# Altium schematic sheet Sheet2.SchDoc
size A3
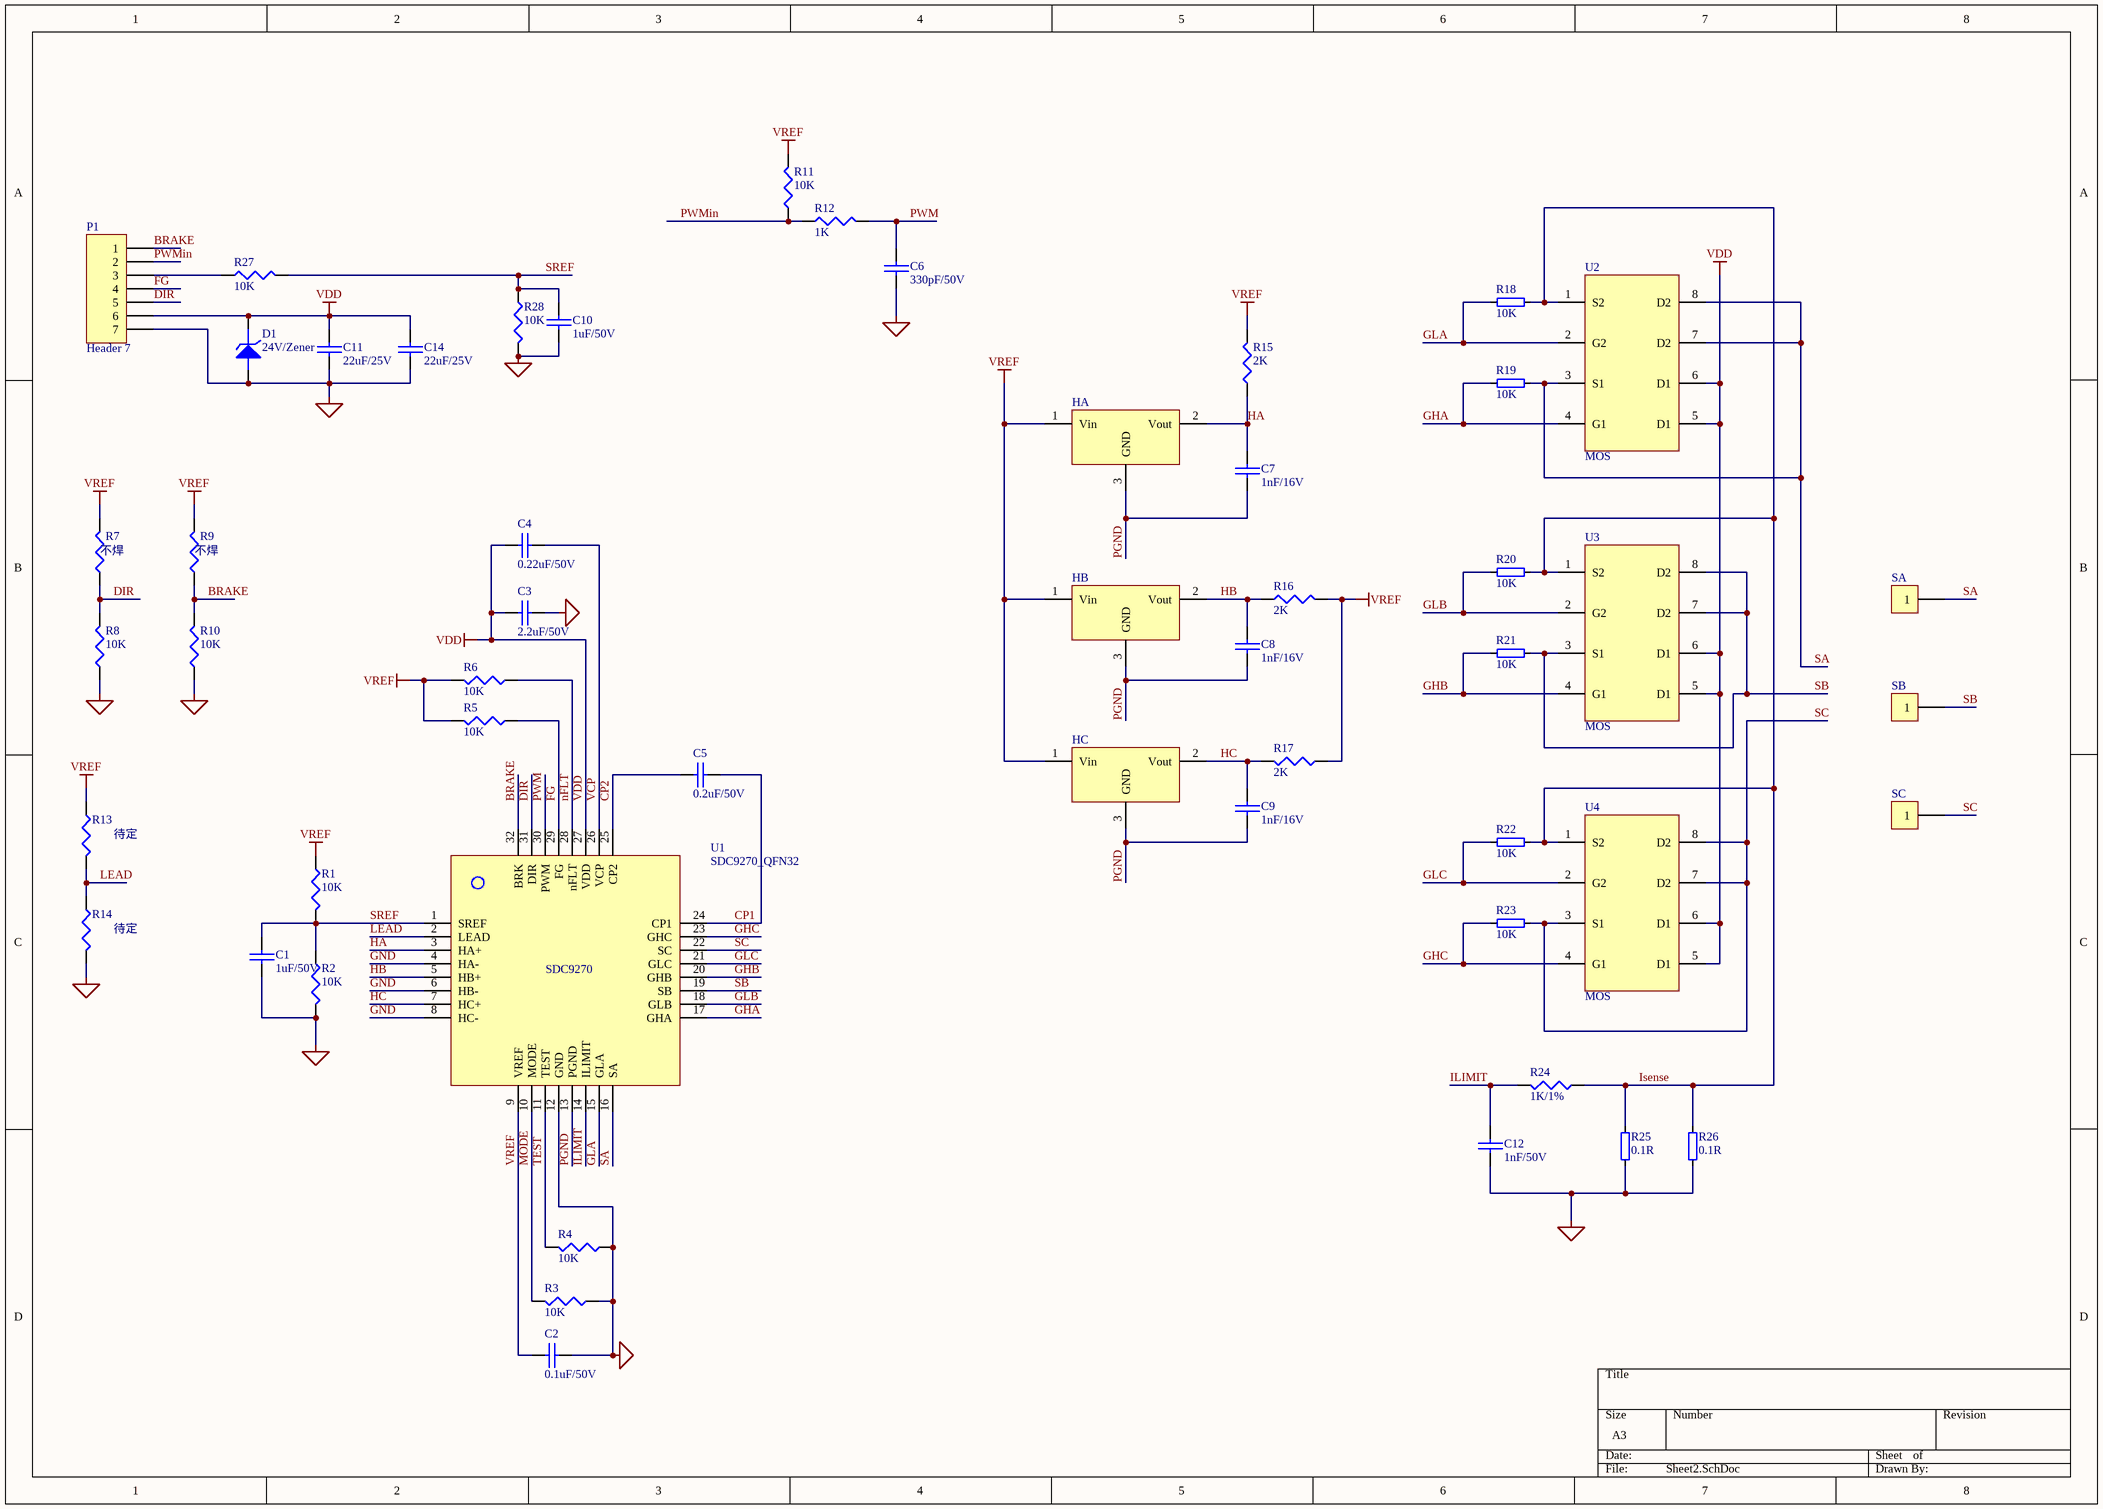
[diagram p0: Sheet2.SchDoc]

## Parts
C1  1uF/50V  [C0603]
C2  0.1uF/50V  [C0603]
C3  2.2uF/50V  [C0603]
C4  0.22uF/50V  [C0603]
C5  0.2uF/50V  [C0603]
C6  330pF/50V  [C0603]
C7  1nF/16V  [C0603]
C8  1nF/16V  [C0603]
C9  1nF/16V  [C0603]
C10  1uF/50V  [C0603]
C11  22uF/25V  [C0603]
C12  1nF/50V  [C0603]
C14  22uF/25V  [C0603]
D1  24V/Zener  [SMB]
HA  HALL_SOT23-3  [SOT-23]  (value not drawn)
HB  HALL_SOT23-3  [SOT-23]  (value not drawn)
HC  HALL_SOT23-3  [SOT-23]  (value not drawn)
P1  Header 7  [HDR1X7]
R1  10K  [R0603]
R2  10K  [R0603]
R3  10K  [R0603]
R4  10K  [R0603]
R5  10K  [R0603]
R6  10K  [R0603]
R7  (no value)  [R0603]
R8  10K  [R0603]
R9  (no value)  [R0603]
R10  10K  [R0603]
R11  10K  [R0603]
R12  1K  [R0603]
R13  (no value)  [R0603]
R14  (no value)  [R0603]
R15  2K  [R0603]
R16  2K  [R0603]
R17  2K  [R0603]
R18  10K  [R0603]
R19  10K  [R0603]
R20  10K  [R0603]
R21  10K  [R0603]
R22  10K  [R0603]
R23  10K  [R0603]
R24  1K/1%  [R0603]
R25  0.1R  [R2512]
R26  0.1R  [R2512]
R27  10K  [R0603]
R28  10K  [R0603]
SA  (no value)  [cp1]
SB  (no value)  [cp1]
SC  (no value)  [cp1]
U1  SDC9270_QFN32  [QFN32 (5*5)]
U2  MOS  [SOP-8]
U3  MOS  [SOP-8]
U4  MOS  [SOP-8]

## Nets
SGND: C1.2 C2.1 C3.2 C6.1 C10.2 C11.1 C12.1 C14.1 D1.1(A) P1.7 R2.2 R3.1 R4.1 R8.1 R10.1 R14.2 R25.1 R26.1 R28.2 U1.12(GND)
VDD: C3.1 C4.1 C11.2 C14.2 D1.2(K) P1.6 U1.27(VDD) U2.5(D1) U2.6(D1) U3.5(D1) U3.6(D1) U4.5(D1) U4.6(D1)
VREF: C2.2 HA.1(Vin) HB.1(Vin) HC.1(Vin) R1.1 R5.2 R6.2 R7.2 R9.2 R11.2 R13.1 R15.2 R16.2 R17.1 U1.9(VREF)
BRAKE: P1.1 R9.1 R10.2 U1.32(BRK)
CP1: C5.1 U1.24(CP1)
CP2: C5.2 U1.25(CP2)
DIR: P1.5 R7.1 R8.2 U1.31(DIR)
FG: P1.4 R5.1 U1.29(FG)
GHA: R19.1 U1.17(GHA) U2.4(G1)
GHB: R21.2 U1.20(GHB) U3.4(G1)
GHC: R23.1 U1.23(GHC) U4.4(G1)
GLA: R18.2 U1.15(GLA) U2.2(G2)
GLB: R20.1 U1.18(GLB) U3.2(G2)
GLC: R22.2 U1.21(GLC) U4.2(G2)
GND: U1.4(HA-) U1.6(HB-) U1.8(HC-)
HA: C7.2 HA.2(Vout) R15.1 U1.3(HA+)
HB: C8.2 HB.2(Vout) R16.1 U1.5(HB+)
HC: C9.2 HC.2(Vout) R17.2 U1.7(HC+)
ILIMIT: C12.2 R24.2 U1.14(ILIMIT)
Isense: R18.1 R20.2 R22.1 R24.1 R25.2 R26.2 U2.1(S2) U3.1(S2) U4.1(S2)
LEAD: R13.2 R14.1 U1.2(LEAD)
MODE: R3.2 U1.10(MODE)
nFLT: R6.1 U1.28(nFLT)
PGND: C7.1 C8.1 C9.1 HA.3(GND) HB.3(GND) HC.3(GND) U1.13(PGND)
PWM: C6.2 R12.2 U1.30(PWM)
PWMin: P1.2 R11.1 R12.1
SA: R19.2 SA.1 U1.16(SA) U2.3(S1) U2.7(D2) U2.8(D2)
SB: R21.1 SB.1 U1.19(SB) U3.3(S1) U3.7(D2) U3.8(D2)
SC: R23.2 SC.1 U1.22(SC) U4.3(S1) U4.7(D2) U4.8(D2)
SREF: C1.1 C10.1 R1.2 R2.1 R27.2 R28.1 U1.1(SREF)
TEST: R4.2 U1.11(TEST)
VCP: C4.2 U1.26(VCP)
NetP1_3: P1.3 R27.1

## Notes on the sheet
- (near R7) 不焊
- (near R9) 不焊
- (near R13) 待定
- (near R14) 待定
- (in symbol SDC9270_QFN32) SDC9270

## Library data of the parts
C1 C6-C12 C14 = C0603
C2 C4 C5 = C0805
C3 = C1206
D1 = Zener_SOD-123: Zener Diode
P1 = Header 7: Header, 7-Pin; LatestRevisionDate: 17-Jul-2002; LatestRevisionNote: Re-released for DXP Platform.; Publisher: Altium Limited
R1-R17 R24 R27 R28 = R0603
R18-R23 = R1_0603
R25 R26 = R2512
SA SB SC = CON1: Connector